# EAGLE schematic LPC1343 (EAGLE 5.10)
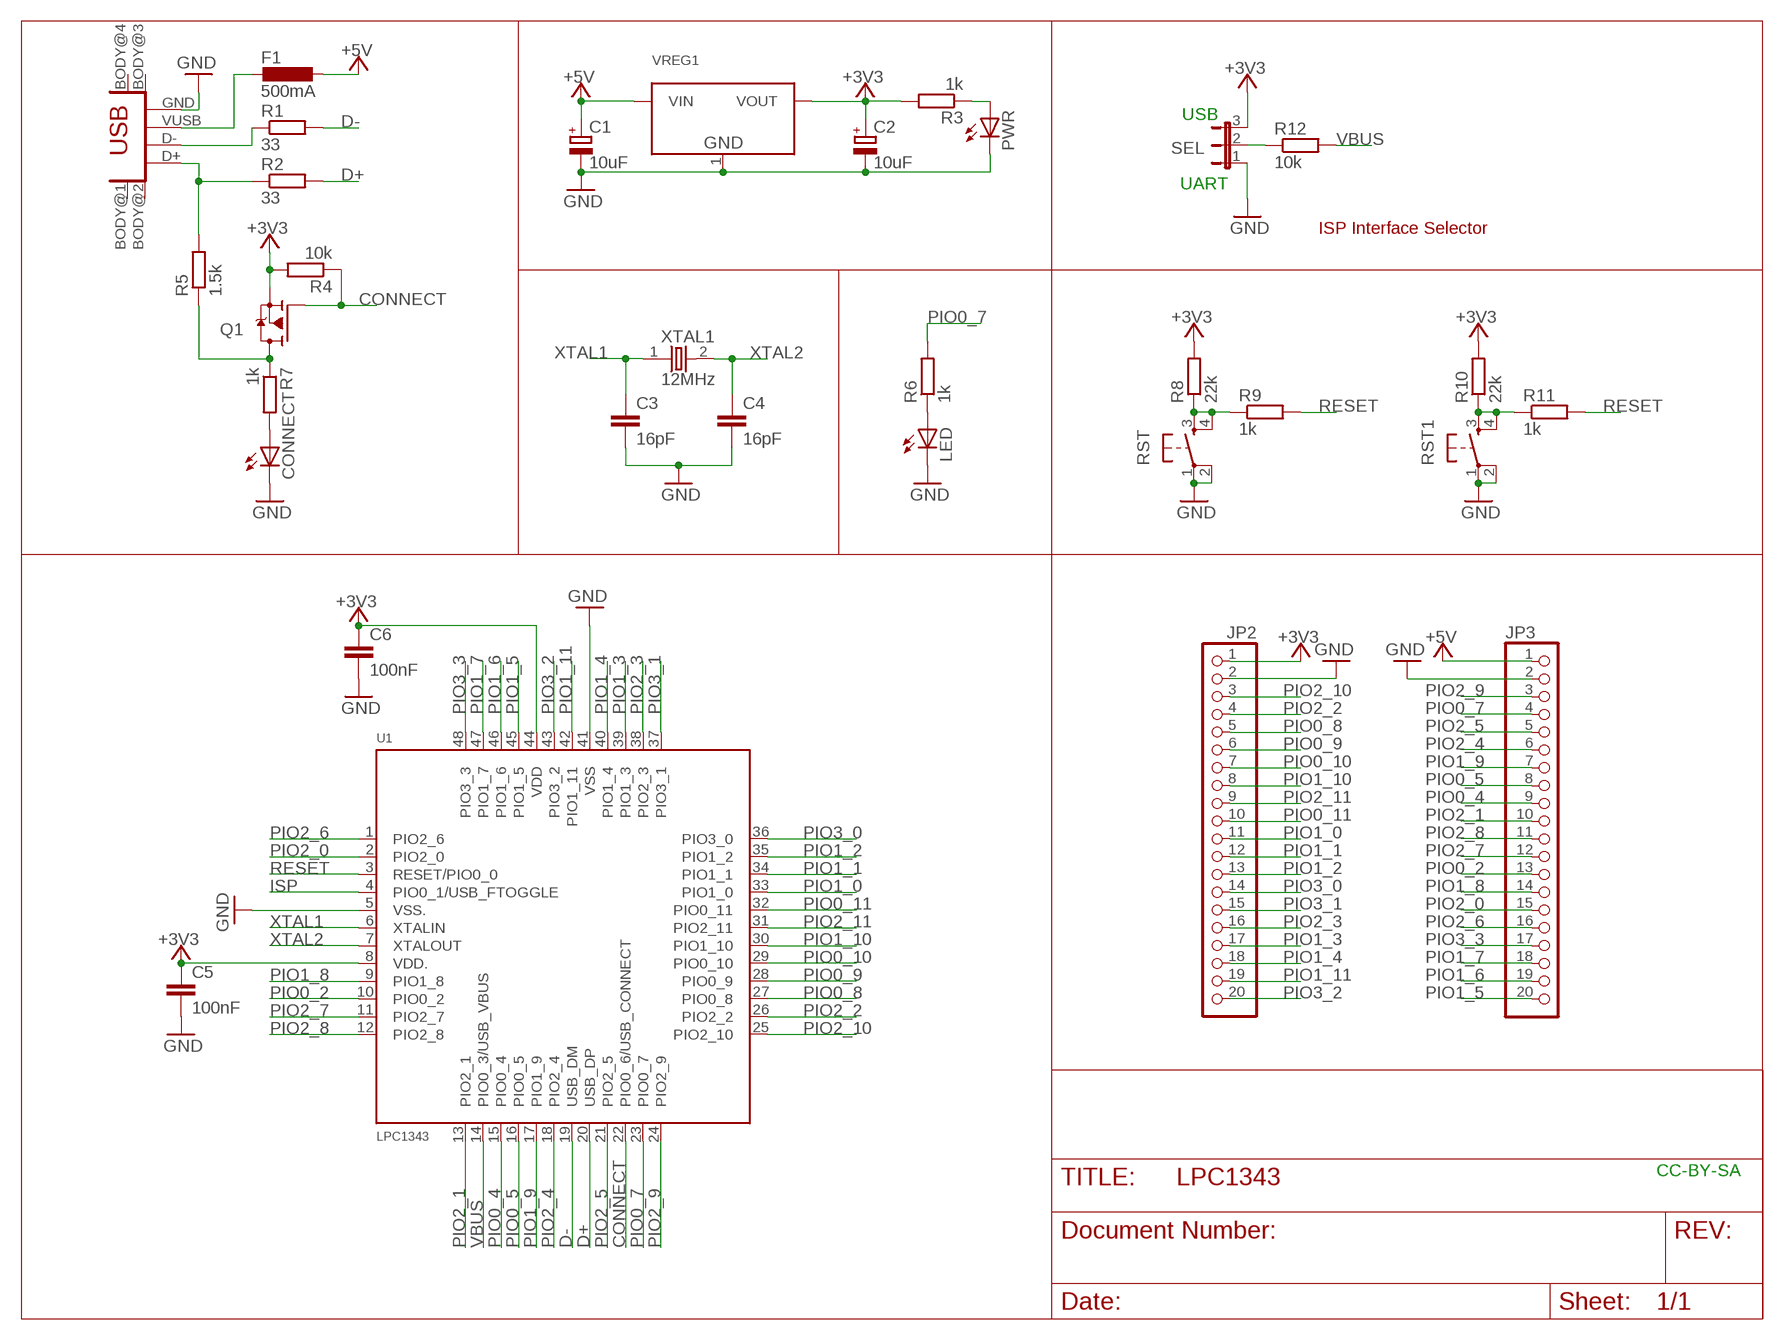
[diagram p0: schematic, sheet 1]

## Parts
C1  10uF  CAP_POLSMC_A  [SMC_A]
C2  10uF  CAP_POLSMC_A  [SMC_A]
C3  16pF  CAPC603  [C603]
C4  16pF  CAPC603  [C603]
C5  100nF  CAPC603  [C603]
C6  100nF  CAPC603  [C603]
CONNECT  LED805  [LED-805]
F1  500mA  L-EUL1812  [L1812]
JP2  PINHD-1X20  [1X20]
JP3  PINHD-1X20  [1X20]
LED  LED805  [LED-805]
PWR  LED805  [LED-805]
Q1  TSM2301CX  [SOT23]
R1  33  RESISTORR603  [R603]
R2  33  RESISTORR603  [R603]
R3  1k  RESISTORR603  [R603]
R4  10k  RESISTORR603  [R603]
R5  1.5k  RESISTORR603  [R603]
R6  1k  RESISTORR603  [R603]
R7  1k  RESISTORR603  [R603]
R8  22k  RESISTORR603  [R603]
R9  1k  RESISTORR603  [R603]
R10  22k  RESISTORR603  [R603]
R11  1k  RESISTORR603  [R603]
R12  10k  RESISTORR603  [R603]
RST  SMD_TACT_SMALL  [TACT_SWITCH_SMALL]
RST1  SMD_TACT_SMALL  [TACT_SWITCH_SMALL]
SEL  JP2E  [JP2]
U1  LPC1343  LPC1343FBD48  [LQFP48]
USB  CONN_USB  [CONN_USB_MINI-B]
VREG1  LD1117-3.3SOT223  [SOT223]
XTAL1  12MHz  CRYSTAL  [HC-49U]

## Nets
+3V3: C2.+ C5.1 C6.1 JP2.1 Q1.2(S) R3.2 R4.2 R8.2 R10.2 SEL.3 U1.8(VDD.) U1.44(VDD) VREG1.2(VOUT)
+5V: C1.+ F1.1 JP3.1 VREG1.3(VIN)
CONNECT: Q1.1(G) R4.1 U1.22(PIO0_6/USB_CONNECT)
D+: R2.2 U1.20(USB_DP)
D-: R1.2 U1.19(USB_DM)
GND: C1.- C2.- C3.2 C4.2 C5.2 C6.2 CONNECT.C JP2.2 JP3.2 LED.C PWR.C RST1.1 RST1.2 RST.1 RST.2 SEL.1 U1.5(VSS.) U1.41(VSS) VREG1.1(GND)
ISP: U1.4(PIO0_1/USB_FTOGGLE)
N$1: LED.A R6.1
N$2: R1.1 USB.D-
N$3: R2.1 R5.2 USB.D+
N$4: PWR.A R3.1
N$5: R8.1 R9.1 RST.3 RST.4
N$6: Q1.3(D) R5.1 R7.1
N$7: CONNECT.A R7.2
N$8: R10.1 R11.1 RST1.3 RST1.4
N$9: R12.1 SEL.2
N$10: F1.2 USB.VUSB
N$17: USB.GND
PIO0_2: JP3.13 U1.10(PIO0_2)
PIO0_4: JP3.9 U1.15(PIO0_4)
PIO0_5: JP3.8 U1.16(PIO0_5)
PIO0_7: JP3.4 R6.2 U1.23(PIO0_7)
PIO0_8: JP2.5 U1.27(PIO0_8)
PIO0_9: JP2.6 U1.28(PIO0_9)
PIO0_10: JP2.7 U1.29(PIO0_10)
PIO0_11: JP2.10 U1.32(PIO0_11)
PIO1_0: JP2.11 U1.33(PIO1_0)
PIO1_1: JP2.12 U1.34(PIO1_1)
PIO1_2: JP2.13 U1.35(PIO1_2)
PIO1_3: JP2.17 U1.39(PIO1_3)
PIO1_4: JP2.18 U1.40(PIO1_4)
PIO1_5: JP3.20 U1.45(PIO1_5)
PIO1_6: JP3.19 U1.46(PIO1_6)
PIO1_7: JP3.18 U1.47(PIO1_7)
PIO1_8: JP3.14 U1.9(PIO1_8)
PIO1_9: JP3.7 U1.17(PIO1_9)
PIO1_10: JP2.8 U1.30(PIO1_10)
PIO1_11: JP2.19 U1.42(PIO1_11)
PIO2_0: JP3.15 U1.2(PIO2_0)
PIO2_1: JP3.10 U1.13(PIO2_1)
PIO2_2: JP2.4 U1.26(PIO2_2)
PIO2_3: JP2.16 U1.38(PIO2_3)
PIO2_4: JP3.6 U1.18(PIO2_4)
PIO2_5: JP3.5 U1.21(PIO2_5)
PIO2_6: JP3.16 U1.1(PIO2_6)
PIO2_7: JP3.12 U1.11(PIO2_7)
PIO2_8: JP3.11 U1.12(PIO2_8)
PIO2_9: JP3.3 U1.24(PIO2_9)
PIO2_10: JP2.3 U1.25(PIO2_10)
PIO2_11: JP2.9 U1.31(PIO2_11)
PIO3_0: JP2.14 U1.36(PIO3_0)
PIO3_1: JP2.15 U1.37(PIO3_1)
PIO3_2: JP2.20 U1.43(PIO3_2)
PIO3_3: JP3.17 U1.48(PIO3_3)
RESET: R9.2 R11.2 U1.3(RESET/PIO0_0)
VBUS: R12.2 U1.14(PIO0_3/USB_VBUS)
XTAL1: C3.1 U1.6(XTALIN) XTAL1.1
XTAL2: C4.1 U1.7(XTALOUT) XTAL1.2
Unconnected: USB.BODY@1(BODY) USB.BODY@2(BODY) USB.BODY@3(BODY) USB.BODY@4(BODY)

## Notes on the sheet
- USB
- UART
- ISP Interface Selector
- CC-BY-SA

## Library data of the parts
C1 C2 = dp_devices:CAP_POL
C3-C6 = dp_devices:CAP
CONNECT LED PWR = dp_devices:LED
F1 = rcl:L-EU: INDUCTOR, European symbol
JP2 JP3 = pinhead:PINHD-1X20: PIN HEADER
Q1 = dp_devices:TSM2301CX: 20V P-Channel Enhancement Mode MOSFET
R1-R12 = dp_devices:RESISTOR
RST RST1 = dp_devices:SMD_TACT_SMALL
SEL = jumper:JP2E: JUMPER
U1 = dp_devices:LPC1343
USB = dp_devices:CONN_USB: USB connector
VREG1 = dp_devices:LD1117-3.3
XTAL1 = dp_devices:CRYSTAL